# Altium schematic sheet PS2_keyboard_mouse.SchDoc
size A
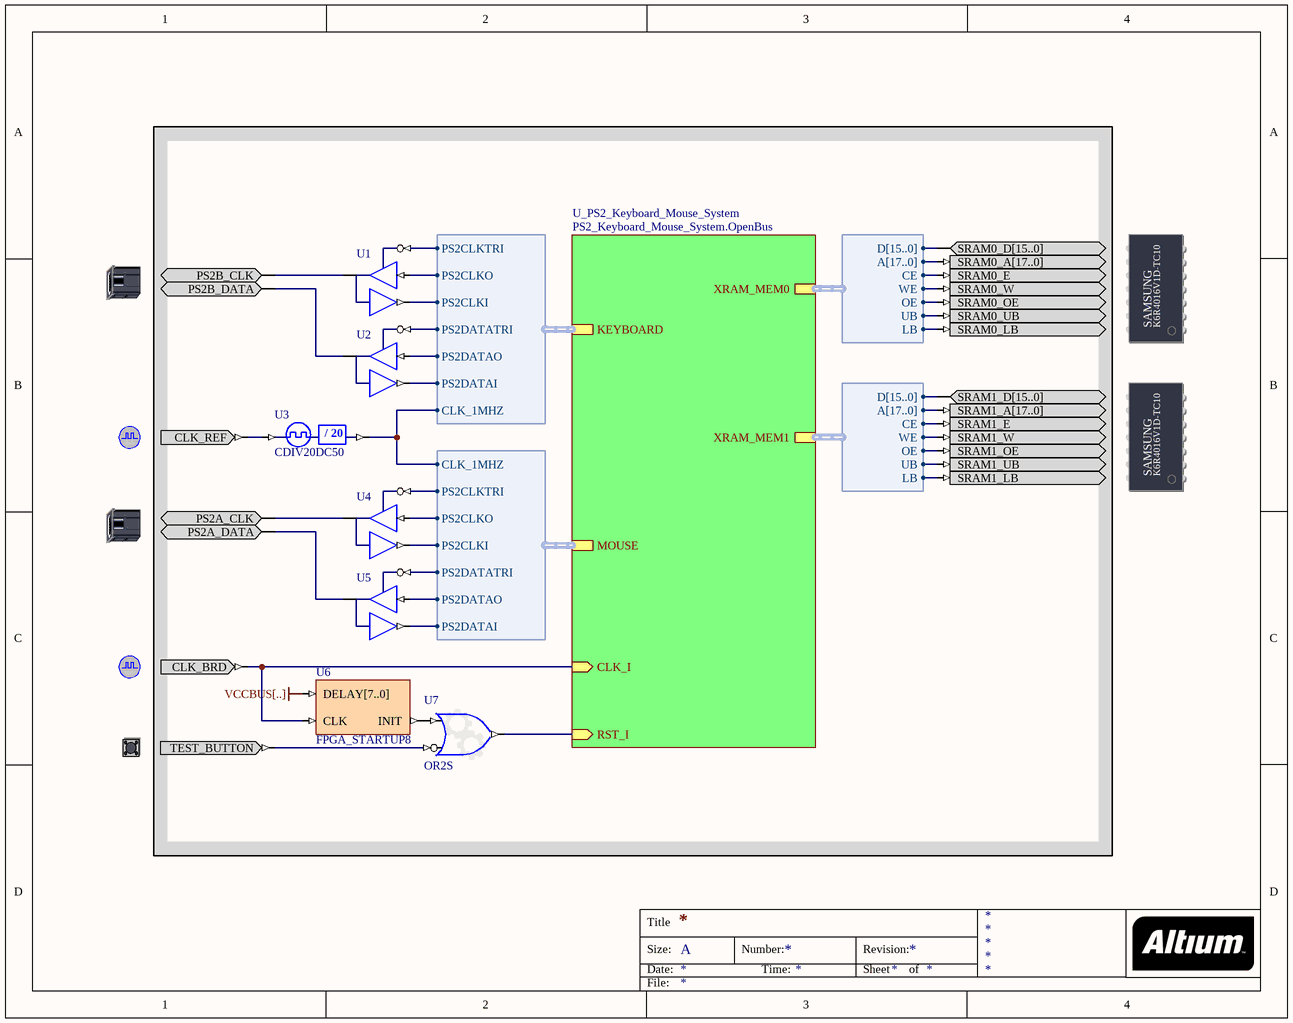
[diagram p0: PS2_keyboard_mouse.SchDoc]

## Parts
(Parts that share a designator on the sheet are numbered #1, #2 ... from top to bottom, then left to right.)
?#1  SRAM_DAUGHTER0  (value not drawn)
?#2  PS2B  (value not drawn)
?#3  SRAM_DAUGHTER1  (value not drawn)
?#4  CLOCK_REFERENCE  (value not drawn)
?#5  PS2A  (value not drawn)
?#6  CLOCK_BOARD  (value not drawn)
?#7  TEST_BUTTON  (value not drawn)
U1  IOBUF  (value not drawn)
U2  IOBUF  (value not drawn)
U3  CDIV20DC50
U4  IOBUF  (value not drawn)
U5  IOBUF  (value not drawn)
U6  FPGA_STARTUP8
U7  OR2S

## Sub-sheets
U_PS2_Keyboard_Mouse_System = PS2_Keyboard_Mouse_System.OpenBus: XRAM_MEM0 (harness WB_MEM_CTRL_SRAM16_A18), XRAM_MEM1 (harness WB_MEM_CTRL_SRAM16_A18), MOUSE (harness PS2_W), KEYBOARD (harness PS2_W), RST_I (in), CLK_I (in)

## Harnesses
WB_MEM_CTRL_SRAM16_A18: D[15..0], A[17..0], CE, WE, OE, UB, LB
PS2_W: PS2CLKTRI, PS2CLKO, PS2CLKI, PS2DATATRI, PS2DATAO, PS2DATAI, CLK_1MHZ

## Nets
VCCBUS[..]: U6.DELAY[7..0]
Net?#1_SRAM0_A[17..0]: ?#1.SRAM0_A[17..0] ; sheet U_PS2_Keyboard_Mouse_System/XRAM_MEM0.A[17..0]
Net?#1_SRAM0_D[15..0]: ?#1.SRAM0_D[15..0] ; sheet U_PS2_Keyboard_Mouse_System/XRAM_MEM0.D[15..0]
Net?#1_SRAM0_E: ?#1.SRAM0_E ; sheet U_PS2_Keyboard_Mouse_System/XRAM_MEM0.CE
Net?#1_SRAM0_LB: ?#1.SRAM0_LB ; sheet U_PS2_Keyboard_Mouse_System/XRAM_MEM0.LB
Net?#1_SRAM0_OE: ?#1.SRAM0_OE ; sheet U_PS2_Keyboard_Mouse_System/XRAM_MEM0.OE
Net?#1_SRAM0_UB: ?#1.SRAM0_UB ; sheet U_PS2_Keyboard_Mouse_System/XRAM_MEM0.UB
Net?#1_SRAM0_W: ?#1.SRAM0_W ; sheet U_PS2_Keyboard_Mouse_System/XRAM_MEM0.WE
Net?#2_PS2B_CLK: ?#2.PS2B_CLK U1.IO
Net?#2_PS2B_DATA: ?#2.PS2B_DATA U2.IO
Net?#3_SRAM1_A[17..0]: ?#3.SRAM1_A[17..0] ; sheet U_PS2_Keyboard_Mouse_System/XRAM_MEM1.A[17..0]
Net?#3_SRAM1_D[15..0]: ?#3.SRAM1_D[15..0] ; sheet U_PS2_Keyboard_Mouse_System/XRAM_MEM1.D[15..0]
Net?#3_SRAM1_E: ?#3.SRAM1_E ; sheet U_PS2_Keyboard_Mouse_System/XRAM_MEM1.CE
Net?#3_SRAM1_LB: ?#3.SRAM1_LB ; sheet U_PS2_Keyboard_Mouse_System/XRAM_MEM1.LB
Net?#3_SRAM1_OE: ?#3.SRAM1_OE ; sheet U_PS2_Keyboard_Mouse_System/XRAM_MEM1.OE
Net?#3_SRAM1_UB: ?#3.SRAM1_UB ; sheet U_PS2_Keyboard_Mouse_System/XRAM_MEM1.UB
Net?#3_SRAM1_W: ?#3.SRAM1_W ; sheet U_PS2_Keyboard_Mouse_System/XRAM_MEM1.WE
Net?#4_CLK_REF: ?#4.CLK_REF U3.CLKIN
Net?#5_PS2A_CLK: ?#5.PS2A_CLK U4.IO
Net?#5_PS2A_DATA: ?#5.PS2A_DATA U5.IO
Net?#6_CLK_BRD: ?#6.CLK_BRD U6.CLK ; sheet U_PS2_Keyboard_Mouse_System/CLK_I
Net?#7_TEST_BUTTON: ?#7.TEST_BUTTON U7.I1
NetU1_I: U1.I ; sheet U_PS2_Keyboard_Mouse_System/KEYBOARD.PS2CLKO
NetU1_O: U1.O ; sheet U_PS2_Keyboard_Mouse_System/KEYBOARD.PS2CLKI
NetU1_T: U1.T ; sheet U_PS2_Keyboard_Mouse_System/KEYBOARD.PS2CLKTRI
NetU2_I: U2.I ; sheet U_PS2_Keyboard_Mouse_System/KEYBOARD.PS2DATAO
NetU2_O: U2.O ; sheet U_PS2_Keyboard_Mouse_System/KEYBOARD.PS2DATAI
NetU2_T: U2.T ; sheet U_PS2_Keyboard_Mouse_System/KEYBOARD.PS2DATATRI
NetU3_CLKDV: U3.CLKDV ; sheet U_PS2_Keyboard_Mouse_System/KEYBOARD.CLK_1MHZ, sheet U_PS2_Keyboard_Mouse_System/MOUSE.CLK_1MHZ
NetU4_I: U4.I ; sheet U_PS2_Keyboard_Mouse_System/MOUSE.PS2CLKO
NetU4_O: U4.O ; sheet U_PS2_Keyboard_Mouse_System/MOUSE.PS2CLKI
NetU4_T: U4.T ; sheet U_PS2_Keyboard_Mouse_System/MOUSE.PS2CLKTRI
NetU5_I: U5.I ; sheet U_PS2_Keyboard_Mouse_System/MOUSE.PS2DATAO
NetU5_O: U5.O ; sheet U_PS2_Keyboard_Mouse_System/MOUSE.PS2DATAI
NetU5_T: U5.T ; sheet U_PS2_Keyboard_Mouse_System/MOUSE.PS2DATATRI
NetU6_INIT: U6.INIT U7.I0
NetU7_O: U7.O ; sheet U_PS2_Keyboard_Mouse_System/RST_I

## Notes on the sheet
- Title
- Size:
- Date:
- A
- Number:
- Time:
- Revision:
- Sheet
- of
- File:
- (in symbol CDIV20DC50) / 20
- (in symbol SRAM_DAUGHTER0) SAMSUNG; K6R4016V1D-TC10
- (in symbol SRAM_DAUGHTER1) SAMSUNG; K6R4016V1D-TC10

## Library data of the parts
?#1 = SRAM_DAUGHTER0: Free Static RAM - Daughterboard; PortComponent: True; Published: 14-May-2007; Publisher: Altium Limited; HelpURL: TR0149 Technical Reference for Altium's Xilinx Spartan-3 Daughter Board DB30.pdf#page=16
?#2 = PS2B: Key Board PS2 Connector; PortComponent: True; Published: 19-Nov-2003; Publisher: Altium Limited; HelpURL: TR0143 Technical Reference Manual for Altium's Desktop NanoBoard NB2DSK01.pdf#page=46
?#3 = SRAM_DAUGHTER1: Free Static RAM - Daughterboard; PortComponent: True; Published: 14-May-2007; Publisher: Altium Limited; HelpURL: TR0149 Technical Reference for Altium's Xilinx Spartan-3 Daughter Board DB30.pdf#page=16
?#4 = CLOCK_REFERENCE: Global System Clock Reference Supply; PortComponent: True; Published: 19-Nov-2003; Publisher: Altium Limited; HelpURL: TR0143 Technical Reference Manual for Altium's Desktop NanoBoard NB2DSK01.pdf#page=41
?#5 = PS2A: Mouse PS2 Connector; PortComponent: True; Published: 19-Nov-2003; Publisher: Altium Limited; HelpURL: TR0143 Technical Reference Manual for Altium's Desktop NanoBoard NB2DSK01.pdf#page=46
?#6 = CLOCK_BOARD: Global System Clock Supply; PortComponent: True; Published: 19-Nov-2003; Publisher: Altium Limited; HelpURL: TR0143 Technical Reference Manual for Altium's Desktop NanoBoard NB2DSK01.pdf#page=41; UseInDSF: True
?#7 = TEST_BUTTON: Test / Reset Button; PortComponent: True; Published: 19-Nov-2003; Publisher: Altium Limited; HelpURL: TR0143 Technical Reference Manual for Altium's Desktop NanoBoard NB2DSK01.pdf#page=53
U1 U2 U4 U5 = IOBUF: Input/Output Buffer; Enable: Low; Control: Common Control T; ArchiveName: GENERIC; VHDLIB_SIM: GENERIC_LIB; Published: 29-Jan-2004; Publisher: Altium Limited; XilinxEquivalent: IOBUF; LastRevisionNo: 1.00.00; HelpURL: CR0118 FPGA Generic Library Guide.pdf#page=293; ComponentLink1URL: CR0125 FPGA Buffer Resource Usage.pdf#page=78; ComponentLink1Description: Core &Resource Usage; FunctionalClass: Buffer; SubClass: IOBUF
U3 = CDIV20DC50: Clock Divider by 20 with 50% Duty Cycle Output; DivisorRate: 20; DutyCycle: 50; ArchiveName: GENERIC; VHDLIB_SIM: GENERIC_LIB; Published: 29-Jan-2004; Publisher: Altium Limited; LastRevisionNo: 1.00.00; HelpURL: CR0118 FPGA Generic Library Guide.pdf#page=143; ComponentLink1URL: CR0127 FPGA Clock Divider Resource Usage.pdf#page=21; ComponentLink1Description: Core &Resource Usage; FunctionalClass: Clock Divider
U6 = FPGA_STARTUP8: FPGA Startup With 8 Bit Delay; Published: 9-Dec-2004; Publisher: Altium Limited; HelpURL: CR0119 FPGA_STARTUPx Powerup Delay Unit.pdf; LastRevisionNo: 1.00.00; ComponentLink1Description: Core &Resource Usage; ComponentLink1URL: CR0139 FPGA Peripheral Resource Usage.pdf#page=11
U7 = GATE: Configurable Generic Gate; ConfiguratorName: GENERIC_GATE; ConfigurationParameters: {}Version[1.0]{}GateKind[OR]{}BusInput[False]{}GateInputType[Bit]{}GateOutputOption[Normal]{}BusWidth[8]{}RegisterOutputs[False]{}NegativeClockEdge[False]{}InputCount[2]{}InputInvert0[False]{}InputInvert1[True]{}; LastRevisionNo: 1.00.00; Published: 3-Sep-2008; Publisher: Altium Limited